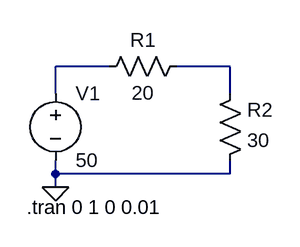
[diagram p0: schematic Tutorial_LTSpice_Ep2-DivisorResistivo.asc]
Tutorial_LTSpice_Ep2-DivisorResistivo.asc, the LTspice schematic file:
Version 4
SHEET 1 880 680
WIRE 192 80 128 80
WIRE 336 80 272 80
WIRE 128 112 128 80
WIRE 336 112 336 80
WIRE 128 208 128 192
WIRE 336 208 336 192
WIRE 336 208 128 208
WIRE 128 224 128 208
FLAG 128 224 0
SYMBOL voltage 128 96 R0
WINDOW 123 0 0 Left 0
WINDOW 39 0 0 Left 0
SYMATTR InstName V1
SYMATTR Value 50
SYMBOL res 288 64 R90
WINDOW 0 0 56 VBottom 2
WINDOW 3 32 56 VTop 2
SYMATTR InstName R1
SYMATTR Value 20
SYMBOL res 320 208 M180
WINDOW 0 36 76 Left 2
WINDOW 3 36 40 Left 2
SYMATTR InstName R2
SYMATTR Value 30
TEXT 94 248 Left 2 !.tran 0 1 0 0.01

The netlist it stands for:
* Tutorial_LTSpice_Ep2-DivisorResistivo.asc
V1 N001 0 50
R1 N002 N001 20
R2 0 N002 30
.tran 0 1 0 0.01
.backanno
.end